# Altium schematic sheet carteAction2026.SchDoc: Carte Actionneurs 2024-2025
size A4; DrawnBy: Oriane Doucet; DocumentNumber: 1/2; Revision: V1; SheetNumber: 1; SheetTotal: 2
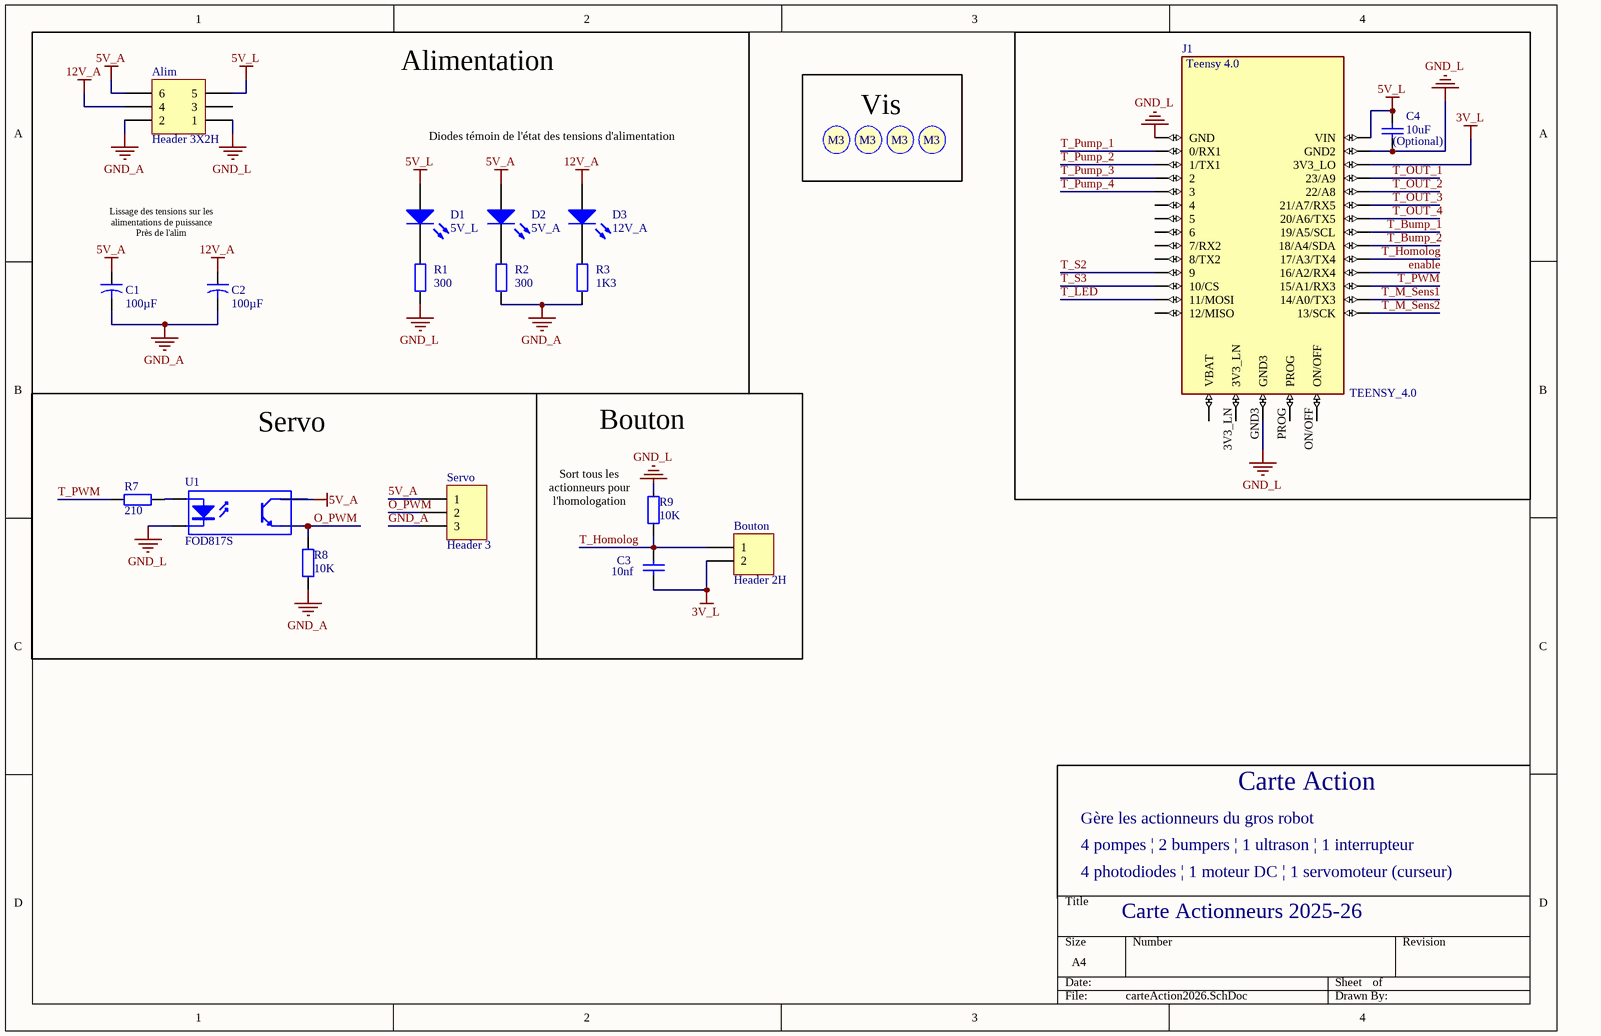
[diagram p0: carteAction2026.SchDoc]

## Parts
Alim  Header 3X2H  [MOLEX_MINIFITJR_3X2]
Bouton  Header 2H  [S2B-XH-A]
C1  value 100µF  [Condensateur]  (hidden comment: Cap2)
C2  value 100µF  [Condensateur]  (hidden comment: Cap2)
C3  value 10nf  [Capacitor 1206]  (hidden comment: Cap)
C4  (Optional)  value 10uF  [Capacitor 1206]
D1  5V_L  [KP-3216SEC]
D2  5V_A  [KP-3216SEC]
D3  12V_A  [KP-3216SEC]
J1  TEENSY_4.0  [TEENSY_4.0]
R1  value 300  [Resistor 1206]  (hidden comment: Res2)
R2  value 300  [Resistor 1206]  (hidden comment: Res2)
R3  value 1K3  [Resistor 1206]  (hidden comment: Res2)
R7  210  [Resistor 1206]
R8  value 10K  [Resistor 1206]  (hidden comment: Res2)
R9  value 10K  [Resistor 1206]  (hidden comment: Res2)
S1  Screw M3  [Screw M3]  (value not drawn)
S2  Screw M3  [Screw M3]  (value not drawn)
S3  Screw M3  [Screw M3]  (value not drawn)
S4  Screw M3  [Screw M3]  (value not drawn)
Servo  Header 3  [S3B-XH-A]
U1  FOD817S  [SOP254P1016X385-4N]

## Nets
3V_L: Bouton.2 C3.1 J1.3V3_LO
5V_A: Alim.6 C1.1 D2.1(A) Servo.1 U1.4(C)
5V_L: Alim.5 C4.2 D1.1(A) J1.VIN
12V_A: Alim.4 C2.1 D3.1(A)
GND_A: Alim.2 C1.2 C2.2 R2.2 R3.2 R8.1 Servo.3
GND_L: Alim.1 C4.1 J1.GND J1.GND2 J1.GND3 R1.1 R9.1 U1.2(K)
enable: J1.16/A2(16/A2/RX4)
O_PWM: R8.2 Servo.2 U1.3(E)
T_Bump_1: J1.19/A5/SCL
T_Bump_2: J1.18/A4/SDA
T_Homolog: Bouton.1 C3.2 J1.17/A3(17/A3/TX4) R9.2
T_LED: J1.11/MOSI
T_M_Sens1: J1.14/A0(14/A0/TX3)
T_M_Sens2: J1.13/SCK
T_OUT_1: J1.23/A9
T_OUT_2: J1.22/A8
T_OUT_3: J1.21/A7(21/A7/RX5)
T_OUT_4: J1.20/A6(20/A6/TX5)
T_Pump_1: J1.0/RX(0/RX1)
T_Pump_2: J1.1/TX(1/TX1)
T_Pump_3: J1.2
T_Pump_4: J1.3/CANTX(3)
T_PWM: J1.15/A1(15/A1/RX3) R7.1
T_S2: J1.9/CS(9)
T_S3: J1.10/CS
NetD1_2: D1.2(K) R1.2
NetD2_2: D2.2(K) R2.1
NetD3_2: D3.2(K) R3.1
NetR7_2: R7.2 U1.1(A)

Not connected (* = marked no-connect by the designer): Alim 3; J1 3V3_LN 4/CANRX(4) 5 6 7(7/RX2) 8(8/TX2) 12/MISO ON/OFF PROG VBAT\(VBAT)

## Notes on the sheet
- Alimentation
- Vis
- Diodes témoin de l'état des tensions d'alimentation
- Lissage des tensions sur les alimentations de puissance
  Près de l'alim
- Servo
- Bouton
- (near R9) Sort tous les actionneurs pour l'homologation
- 4 pompes | 2 bumpers | 1 ultrason | 1 interrupteur
- Gère les actionneurs du gros robot
- Carte Action
- 4 photodiodes | 1 moteur DC | 1 servomoteur (curseur)
- Carte Actionneurs 2025-26
- (in symbol Screw M3) M3

## Library data of the parts
Alim = Header 3X2H: Header, 3-Pin, Dual row, Right Angle; LatestRevisionDate: 17-Jul-2002; LatestRevisionNote: Re-released for DXP Platform.; Publisher: Altium Limited
Bouton = Header 2H: Header, 2-Pin, Right Angle; LatestRevisionDate: 17-Jul-2002; LatestRevisionNote: Re-released for DXP Platform.; Publisher: Altium Limited
C1 C2 = Cap2: Capacitor; Published: 23-Sep-2002; PackageReference: CAPR5-4X5; Publisher: Altium Limited; PackageDescription: Capacitor; 2 Leads
C3 C4 = Cap: Capacitor; Published: 8-Jun-2000; LatestRevisionDate: 17-Jul-2002; LatestRevisionNote: Re-released for DXP Platform.; PackageReference: RAD-0.3; Publisher: Altium Limited; PackageDescription: Radial Cap, Thru-Hole; 2 Leads; 0.3 in Pin Spacing
D1-D3 = LED2: Typical RED, GREEN, YELLOW, AMBER GaAs LED; Published: 8-Jun-2000; LatestRevisionDate: 17-Jul-2002; LatestRevisionNote: Re-released for DXP Platform.; PackageVersion: Feb-2002; PackageReference: 3.2X1.6X1.1; Publisher: Altium Limited; PackageDescription: SM LED; 2 Flat Leads
J1 = TEENSY_4.0: MF: PJRC; MP: Teensy 4.0; SnapEDA_Link: https://www.snapeda.com/parts/Teensy%204.0/PJRC/view-part/?ref=snap; Package: None; Value: *; Check_prices: https://www.snapeda.com/parts/Teensy%204.0/PJRC/view-part/?ref=eda
R1-R3 R7-R9 = Res2: Resistor; Published: 8-Jun-2000; LatestRevisionDate: 17-Jul-2002; LatestRevisionNote: Re-released for DXP Platform.; PackageReference: AXIAL-0.4; Publisher: Altium Limited; PackageDescription: Axial Device, Thru-Hole; 2 Leads; 0.4 in Pin Spacing
Servo = Header 3: Header, 3-Pin; LatestRevisionDate: 17-Jul-2002; LatestRevisionNote: Re-released for DXP Platform.; Publisher: Altium Limited
U1 = Optoisolator1: 4-Pin Phototransistor Optocoupler; Published: 24-Mar-1999; LatestRevisionDate: 04-Mar-2005; LatestRevisionNote: Sch pins 3 & 4 Swapped.; DatasheetVersion: Nov-2003; PackageReference: DIP-4; Publisher: Altium Limited